# Altium project VCO_Board.PrjPcb
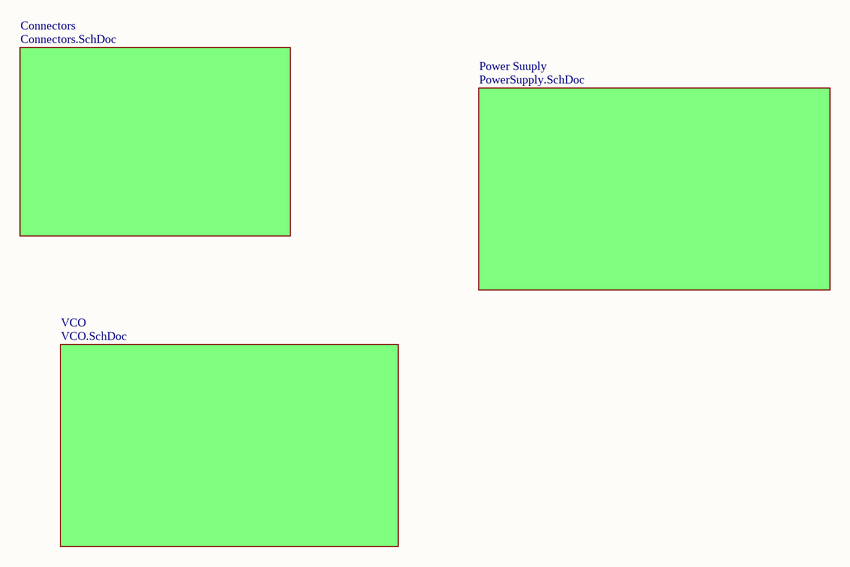
[diagram p0: Board.SchDoc]
5 sheets, 40 parts. Net scope: flat (ports and power ports of the same name join across sheets).
Sheets:
  Board.SchDoc
    Connectors = Connectors.SchDoc
    VCO = VCO.SchDoc
      Filter = LoopFilter.SchDoc
    Power Suuply = PowerSupply.SchDoc

## Sheet Board.SchDoc
size A4; SheetNumber: 1; SheetTotal: 4

### Sub-sheets
Connectors = Connectors.SchDoc: no entries
Power Suuply = PowerSupply.SchDoc: no entries
VCO = VCO.SchDoc: no entries

## Sheet Connectors.SchDoc
size A4; SheetNumber: 3; SheetTotal: 4
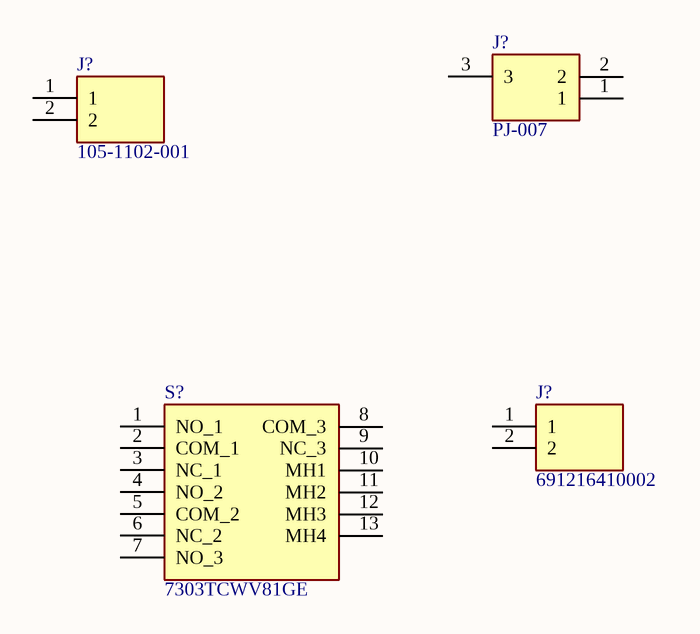
[diagram p1: Connectors.SchDoc]

### Parts
(Parts that share a designator on the sheet are numbered #1, #2 ... from top to bottom, then left to right.)
J?#1  PJ-007  [PJ007]
J?#2  105-1102-001  [1051102001]
J?#3  691216410002  [691216410002]
S?  7303TCWV81GE  [7303TCWV81GE]

### Nets

Not connected (* = marked no-connect by the designer): J?#1 1 2 3; J?#2 1 2; J?#3 1 2; S? 1(NO_1) 2(COM_1) 3(NC_1) 4(NO_2) 5(COM_2) 6(NC_2) 7(NO_3) 8(COM_3) 9(NC_3) 10(MH1) 11(MH2) 12(MH3) 13(MH4)

### Library data of the parts
J?#1 = PJ-007: Connector; Manufacturer_Name: Same Sky; Datasheet Link: https://www.sameskydevices.com/product/resource/supplyframepdf/pj-007.pdf; Height: 7.6mm; Manufacturer_Part_Number: PJ-007; Mouser Part Number: 490-PJ-007; Mouser Price/Stock: https://www.mouser.co.uk/ProductDetail/CUI-Devices/PJ-007?qs=WyjlAZoYn52tkNApkXGfYg%3D%3D; Arrow Part Number: PJ-007; Arrow Price/Stock: https://www.arrow.com/en/products/pj-007/cui-devices?region=nac
J?#2 = 105-1102-001: Connector; Manufacturer_Name: Cinch Connectivity Solutions; Datasheet Link: https://www.mouser.com/datasheet/2/643/pi-CCS-JOHN-105-1102-001-1289590.pdf; Height: 5.16mm; Manufacturer_Part_Number: 105-1102-001; Mouser Part Number: 530-105-1102-1; Mouser Price/Stock: https://www.mouser.co.uk/ProductDetail/Johnson-Cinch-Connectivity-Solutions/105-1102-001?qs=ALatB1zlu3CDNmlfAzCZwg%3D%3D; Arrow Part Number: 105-1102-001; Arrow Price/Stock: https://www.arrow.com/en/products/105-1102-001/cinch-connectivity-solutions?region=nac
J?#3 = 691216410002: Connector; Manufacturer_Name: Wurth Elektronik; Datasheet Link: https://docs.rs-online.com/7a5e/0900766b81734209.pdf; Height: 13.9mm; Manufacturer_Part_Number: 691216410002; Mouser Part Number: 710-691216410002; Mouser Price/Stock: https://www.mouser.co.uk/ProductDetail/Wurth-Elektronik/691216410002?qs=lBTPRtX1sU%2F93qGihT%252BGAQ%3D%3D
S? = 7303TCWV81GE: Switch; Manufacturer_Name: C & K COMPONENTS; Datasheet Link: https://www.ckswitches.com/media/1394/7000toggle.pdf; Height: 38.18mm; Manufacturer_Part_Number: 7303TCWV81GE; Arrow Part Number: 7303TCWV81GE; Arrow Price/Stock: https://www.arrow.com/en/products/7303tcwv81ge/ck

## Sheet VCO.SchDoc
size A4; SheetNumber: 2; SheetTotal: 5
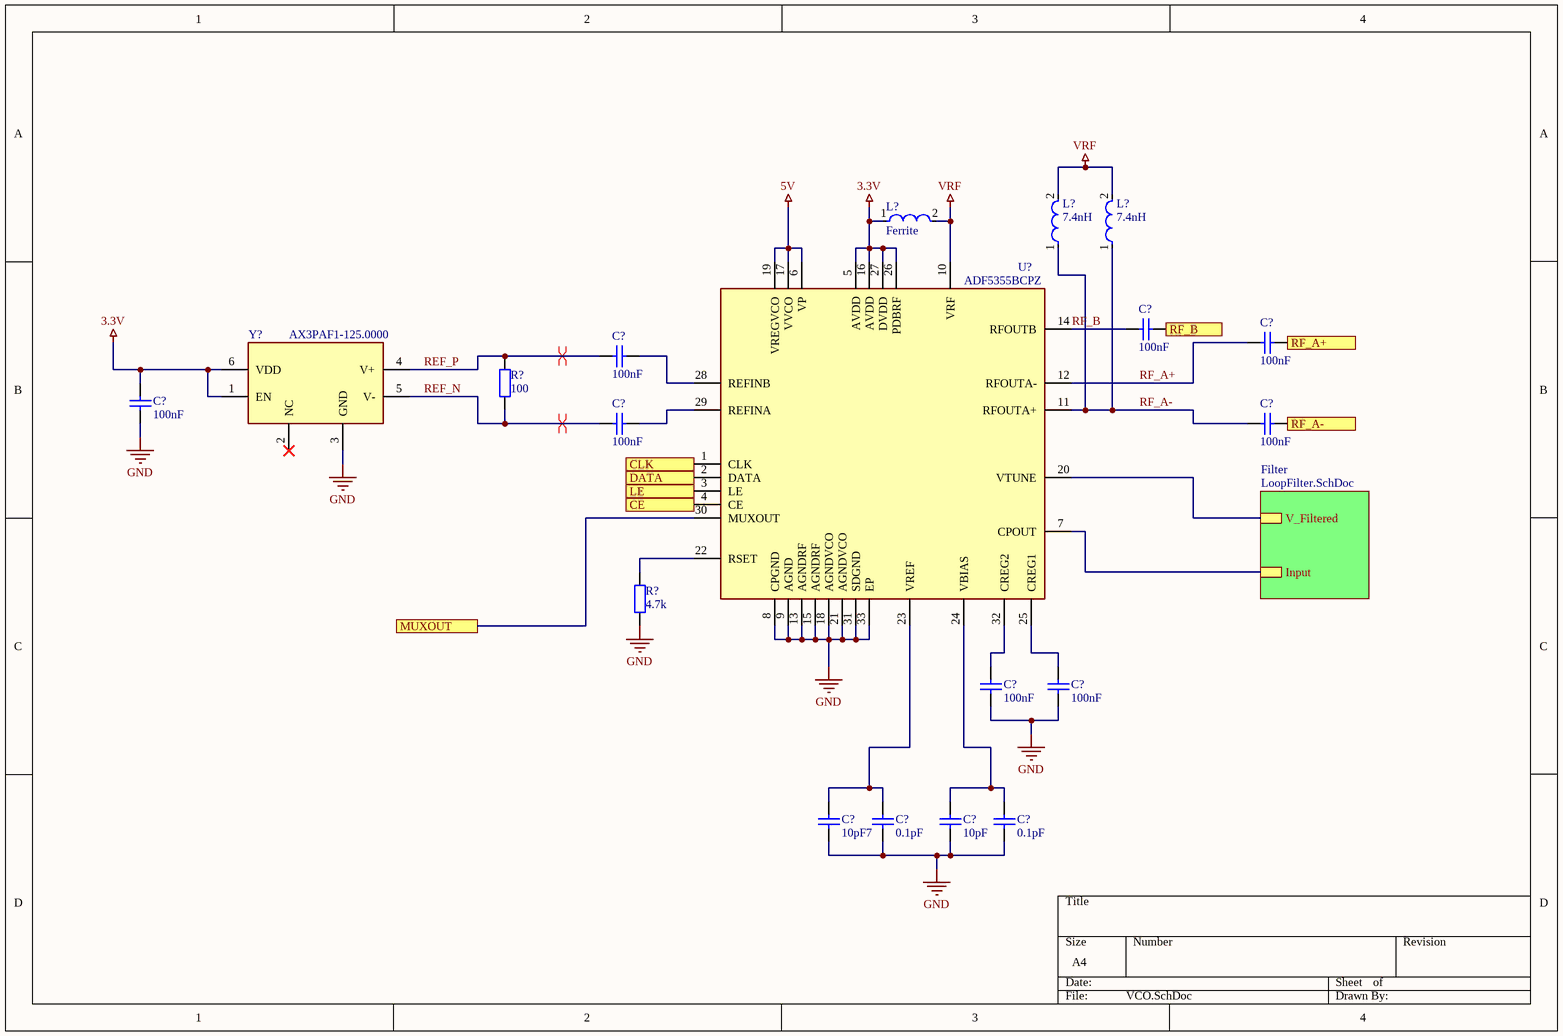
[diagram p2: VCO.SchDoc]

### Parts
(Parts that share a designator on the sheet are numbered #1, #2 ... from top to bottom, then left to right.)
C?#1  100nF  [CAP_0402]
C?#2  100nF  [CAP_0402]
C?#3  100nF  [CAP_0402]
C?#4  100nF  [CAP_0402]
C?#5  100nF  [CAP_0402]
C?#6  100nF  [CAP_0402]
C?#7  100nF  [CAP_0402]
C?#8  100nF  [CAP_0402]
C?#9  10pF7  [CAP_0402]
C?#10  0.1pF  [CAP_0402]
C?#11  10pF  [CAP_0402]
C?#12  0.1pF  [CAP_0402]
L?#1  Ferrite  [FP-LQW18AN_00-MFG]
L?#2  7.4nH  [FP-LQW18AN_00-MFG]
L?#3  7.4nH  [FP-LQW18AN_00-MFG]
R?#1  100  [Res_0402]
R?#2  4.7k  [Res_0402]
U?#1  ADF5355BCPZ  [QFN50P500X500X80-33N-D]
Y?  AX3PAF1-125.0000  [AX3_3.2x2.5]

### Sub-sheets
Filter = LoopFilter.SchDoc: Input, V_Filtered

### Ports
CE, CLK, DATA, LE, MUXOUT, RF_A+, RF_A-, RF_B

### Nets
3.3V: C?#4.2 L?#1.1 U?#1.5(AVDD) U?#1.16(AVDD) U?#1.26(PDBRF) U?#1.27(DVDD) Y?.1(EN) Y?.6(VDD)
5V: U?#1.6(VP) U?#1.17(VVCO) U?#1.19(VREGVCO)
GND: C?#4.1 C?#7.1 C?#8.1 C?#9.1 C?#10.1 C?#11.1 C?#12.1 R?#2.1 U?#1.8(CPGND) U?#1.9(AGND) U?#1.13(AGNDRF) U?#1.15(AGNDRF) U?#1.18(AGNDVCO) U?#1.21(AGNDVCO) U?#1.31(SDGND) U?#1.33(EP) Y?.3(GND)
VRF: L?#1.2 L?#2.2 L?#3.2 U?#1.10(VRF)
REF_N: C?#5.2 R?#1.1 Y?.5(V-)
REF_P: C?#3.2 R?#1.2 Y?.4(V+)
RF_A+: C?#2.2 U?#1.12(RFOUTA-)
RF_A-: C?#6.2 L?#2.1 L?#3.1 U?#1.11(RFOUTA+)
RF_B: C?#1.2 U?#1.14(RFOUTB)
NetC?#1_1: C?#1.1 ; port RF_B
NetC?#2_1: C?#2.1 ; port RF_A+
NetC?#3_1: C?#3.1 U?#1.28(REFINB)
NetC?#5_1: C?#5.1 U?#1.29(REFINA)
NetC?#6_1: C?#6.1 ; port RF_A-
NetC?#7_2: C?#7.2 U?#1.32(CREG2)
NetC?#8_2: C?#8.2 U?#1.25(CREG1)
NetC?#9_2: C?#9.2 C?#10.2 U?#1.23(VREF)
NetC?#11_2: C?#11.2 C?#12.2 U?#1.24(VBIAS)
NetR?#2_2: R?#2.2 U?#1.22(RSET)
NetU?#1_1: U?#1.1(CLK) ; port CLK
NetU?#1_2: U?#1.2(DATA) ; port DATA
NetU?#1_3: U?#1.3(LE) ; port LE
NetU?#1_4: U?#1.4(CE) ; port CE
NetU?#1_7: U?#1.7(CPOUT) ; sheet Filter/Input
NetU?#1_20: U?#1.20(VTUNE) ; sheet Filter/V_Filtered
NetU?#1_30: U?#1.30(MUXOUT) ; port MUXOUT

Not connected (* = marked no-connect by the designer): Y? 2(NC)*

### Layout directives
differential pair: REF_N, REF_P

### Library data of the parts
C?#1-C?#12 = Capacitor: Manufacturer: Murata; Part Number: GRM155R71E103KA01D
L?#1 = Ferrite_bead: Test Frequency: 100MHz; DC Current: 500mA; Current: 400mA; Series Resistance: 170mR; Tolerance: 2%; Core Material: Non-Magnetic; Shielding: Unshielded; Self Resonant Frequency: 4.6GHz; Inductance: 22nH; Q Factor: 40; Weight: 0.000106oz; Military Standard: Not; Case/Package: 0603; Case Code (Metric): 1608; Width: 0.8mm; Length: 1.6mm; Depth: 1mm; REACH SVHC: No SVHC; Case Code (Imperial): 0603; Lead Free: Lead Free; Mount: Surface Mount; Resistor Type: Wirewound; Inductance Tolerance: 2%; Number of Pins: 2; Termination: SMD/SMT; Package Quantity: 4000; Height - Seated (Max): 0.039inch; Height: 0.8mm; Packaging: Tape and Reel; Max DC Current: 500mA; Current Rating: 500mA; Min Operating Temperature: -55°C; DC Resistance (DCR): 170mR; Max Operating Temperature: 125°C
L?#2 L?#3 = Inductor: Test Frequency: 100MHz; DC Current: 500mA; Current: 400mA; Series Resistance: 170mR; Tolerance: 2%; Core Material: Non-Magnetic; Shielding: Unshielded; Self Resonant Frequency: 4.6GHz; Inductance: 22nH; Q Factor: 40; Weight: 0.000106oz; Military Standard: Not; Case/Package: 0603; Case Code (Metric): 1608; Width: 0.8mm; Length: 1.6mm; Depth: 1mm; REACH SVHC: No SVHC; Case Code (Imperial): 0603; Lead Free: Lead Free; Mount: Surface Mount; Resistor Type: Wirewound; Inductance Tolerance: 2%; Number of Pins: 2; Termination: SMD/SMT; Package Quantity: 4000; Height - Seated (Max): 0.039inch; Height: 0.8mm; Packaging: Tape and Reel; Max DC Current: 500mA; Current Rating: 500mA; Min Operating Temperature: -55°C; DC Resistance (DCR): 170mR; Max Operating Temperature: 125°C
R?#1 R?#2 = Resistor_EU
U?#1 = ADF5355BCPZ: Integrated Circuit; Manufacturer_Name: Analog Devices; Datasheet Link: https://componentsearchengine.com/Datasheets/2/ADF5355BCPZ.pdf; Height: 0.8mm; Manufacturer_Part_Number: ADF5355BCPZ; Mouser Part Number: 584-ADF5355BCPZ; Mouser Price/Stock: https://www.mouser.co.uk/ProductDetail/Analog-Devices/ADF5355BCPZ?qs=hpwIUhX6lWz%252By8O4aZ7X5w%3D%3D; Arrow Part Number: ADF5355BCPZ; Arrow Price/Stock: https://www.arrow.com/en/products/adf5355bcpz/analog-devices
Y? = AX3PAF1-125.0000: Crystal or Oscillator; Manufacturer_Name: ABRACON; Datasheet Link: https://abracon.com/datasheets/AX3.pdf; Manufacturer_Part_Number: AX3PAF1-125.0000; Mouser Part Number: 815-AX3PAF1-125.0000; Mouser Price/Stock: https://www.mouser.co.uk/ProductDetail/ABRACON/AX3PAF1-1250000?qs=Zz7%252BYVVL6bFYJKyZSka0MA%3D%3D

## Sheet LoopFilter.SchDoc
size A4; SheetNumber: 3; SheetTotal: 5
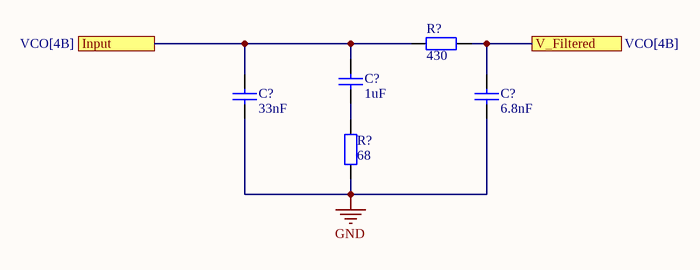
[diagram p3: LoopFilter.SchDoc]

### Parts
(Parts that share a designator on the sheet are numbered #1, #2 ... from top to bottom, then left to right.)
C?#13  1uF  [CAP_0402]
C?#14  33nF  [CAP_0402]
C?#15  6.8nF  [CAP_0402]
R?#3  430  [Res_0402]
R?#4  68  [Res_0402]

### Ports
Input (see VCO[4B]), V_Filtered (see VCO[4B])

### Nets
GND: C?#14.1 C?#15.1 R?#4.1
NetC?#13_1: C?#13.1 R?#4.2
NetC?#13_2: C?#13.2 C?#14.2 R?#3.1 ; port Input
NetC?#15_2: C?#15.2 R?#3.2 ; port V_Filtered

### Library data of the parts
C?#13-C?#15 = Capacitor: as C?#1 on sheet VCO
R?#3 R?#4 = Resistor_EU

## Sheet PowerSupply.SchDoc
size A4; SheetNumber: 5; SheetTotal: 5
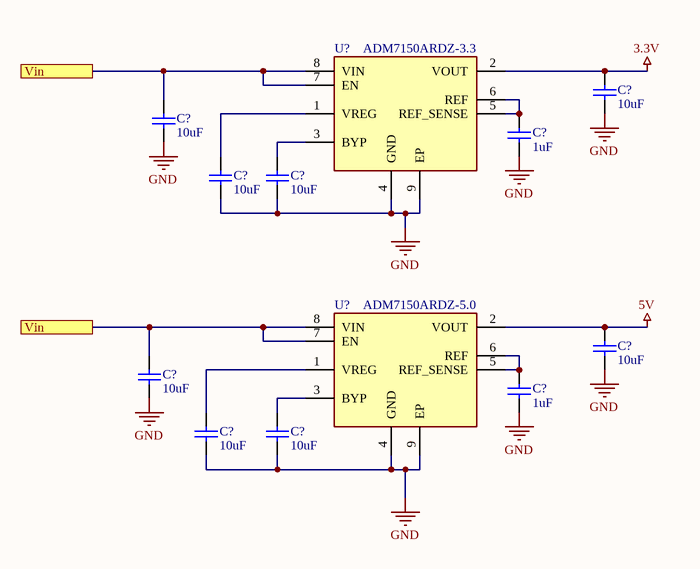
[diagram p4: PowerSupply.SchDoc]

### Parts
(Parts that share a designator on the sheet are numbered #1, #2 ... from top to bottom, then left to right.)
C?#16  10uF  [CAP_0402]
C?#17  10uF  [CAP_0402]
C?#18  1uF  [CAP_0402]
C?#19  10uF  [CAP_0402]
C?#20  10uF  [CAP_0402]
C?#21  10uF  [CAP_0402]
C?#22  10uF  [CAP_0402]
C?#23  1uF  [CAP_0402]
C?#24  10uF  [CAP_0402]
C?#25  10uF  [CAP_0402]
U?#2  ADM7150ARDZ-3.3  [SOIC127P600X175-9N]
U?#3  ADM7150ARDZ-5.0  [SOIC127P600X175-9N]

### Ports
Vin

### Nets
3.3V: C?#16.2 U?#2.2(VOUT)
5V: C?#21.2 U?#3.2(VOUT)
GND: C?#16.1 C?#17.1 C?#18.1 C?#19.1 C?#20.1 C?#21.1 C?#22.1 C?#23.1 C?#24.1 C?#25.1 U?#2.4(GND) U?#2.9(EP) U?#3.4(GND) U?#3.9(EP)
NetC?#17_2: C?#17.2 C?#22.2 U?#2.7(EN) U?#2.8(VIN) U?#3.7(EN) U?#3.8(VIN) ; port Vin
NetC?#18_2: C?#18.2 U?#2.5(REF_SENSE) U?#2.6(REF)
NetC?#19_2: C?#19.2 U?#2.1(VREG)
NetC?#20_2: C?#20.2 U?#2.3(BYP)
NetC?#23_2: C?#23.2 U?#3.5(REF_SENSE) U?#3.6(REF)
NetC?#24_2: C?#24.2 U?#3.1(VREG)
NetC?#25_2: C?#25.2 U?#3.3(BYP)

### Library data of the parts
C?#16-C?#25 = Capacitor: as C?#1 on sheet VCO
U?#2 = ADM7150ARDZ-3.3: Integrated Circuit; Manufacturer_Name: Analog Devices; Datasheet Link: https://www.analog.com/media/en/technical-documentation/data-sheets/ADM7150.pdf; Height: 1.75mm; Manufacturer_Part_Number: ADM7150ARDZ-3.3; Mouser Part Number: 584-ADM7150ARDZ-3.3; Mouser Price/Stock: https://www.mouser.co.uk/ProductDetail/Analog-Devices/ADM7150ARDZ-3.3?qs=J50fqX%2Fl9iqu%2FV4kkGpO0w%3D%3D; Arrow Part Number: ADM7150ARDZ-3.3; Arrow Price/Stock: https://www.arrow.com/en/products/adm7150ardz-3.3/analog-devices?region=europe
U?#3 = ADM7150ARDZ-5.0: Integrated Circuit; Manufacturer_Name: Analog Devices; Datasheet Link: http://www.farnell.com/datasheets/2252893.pdf; Height: 1.75mm; Manufacturer_Part_Number: ADM7150ARDZ-5.0; Mouser Part Number: 584-ADM7150ARDZ-5.0; Mouser Price/Stock: https://www.mouser.co.uk/ProductDetail/Analog-Devices/ADM7150ARDZ-5.0?qs=J50fqX%2Fl9irwq1mMDkiaAg%3D%3D; Arrow Part Number: ADM7150ARDZ-5.0; Arrow Price/Stock: https://www.arrow.com/en/products/adm7150ardz-5.0/analog-devices?region=europe

## Nets that join several sheets
3.3V: VCO (8 pins), PowerSupply (C?#16.2 U?#2.2)
5V: VCO (U?#1.6 U?#1.17 U?#1.19), PowerSupply (C?#21.2 U?#3.2)
GND: VCO (17 pins), LoopFilter (C?#14.1 C?#15.1 R?#4.1), PowerSupply (14 pins)